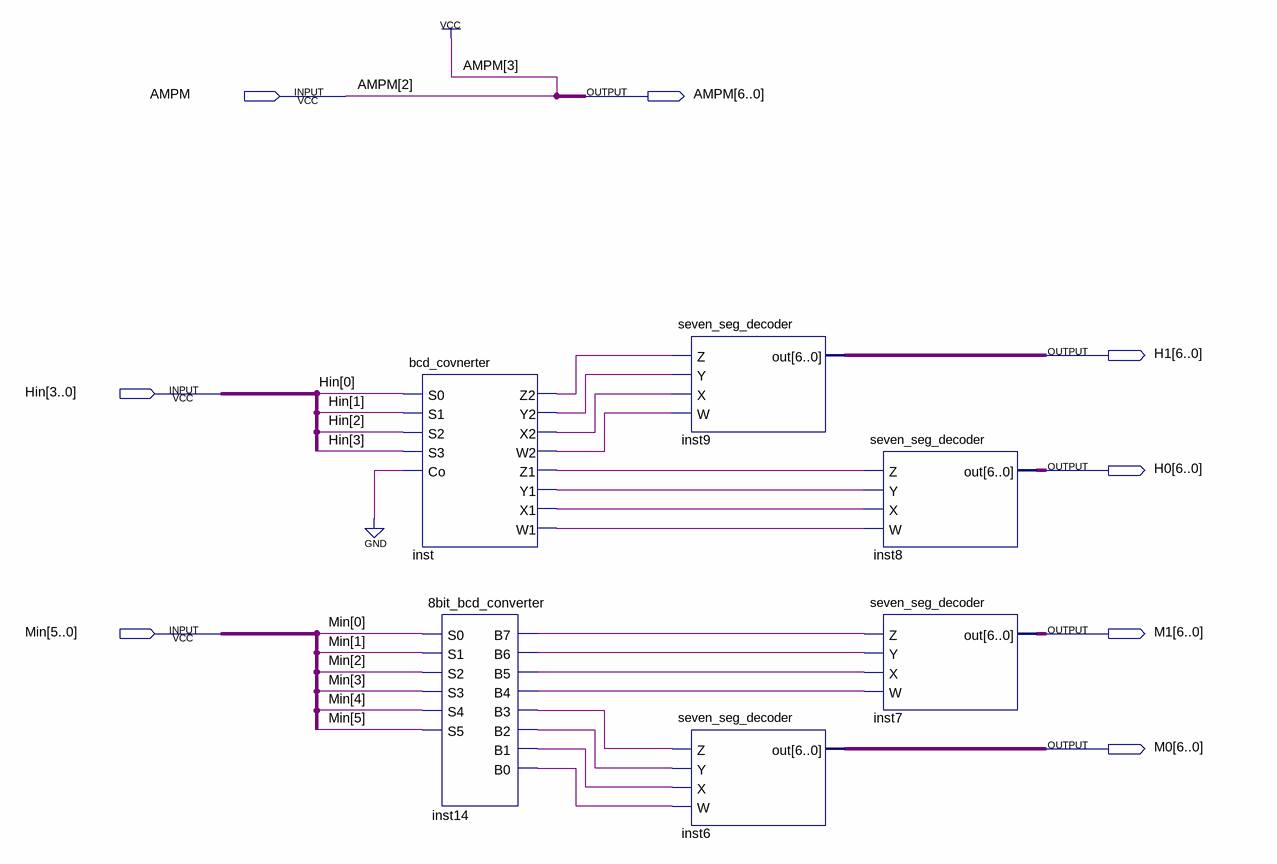
[diagram p0: schematic sheet]
// Quartus schematic timeDecoder.bdf as structural Verilog: 6 symbols, 8 pins
module timeDecoder (
  input  AMPM_1bit,
  input  [3:0] Hin,
  input  [5:0] Min,
  output [6:0] AMPM,
  output [6:0] H1,
  output [6:0] H0,
  output [6:0] M1,
  output [6:0] M0
);

  wire inst14_b0, inst14_b1, inst14_b2, inst14_b3, inst14_b4, inst14_b5, inst14_b6, inst14_b7, inst_w1,
       inst_w2, inst_x1, inst_x2, inst_y1, inst_y2, inst_z1, inst_z2;

  bcd_covnerter inst (
    .S0(Hin[0]), .S1(Hin[1]), .S2(Hin[2]), .S3(Hin[3]), .Co(1'b0), .Z2(inst_z2), .Y2(inst_y2), .X2(inst_x2),
    .W2(inst_w2), .Z1(inst_z1), .Y1(inst_y1), .X1(inst_x1), .W1(inst_w1));
  \8bit_bcd_converter  inst14 (
    .S0(Min[0]), .S1(Min[1]), .S2(Min[2]), .S3(Min[3]), .S4(Min[4]), .S5(Min[5]), .B7(inst14_b7),
    .B6(inst14_b6), .B5(inst14_b5), .B0(inst14_b0), .B4(inst14_b4), .B3(inst14_b3), .B2(inst14_b2),
    .B1(inst14_b1));
  seven_seg_decoder inst9 (.Z(inst_z2), .Y(inst_y2), .X(inst_x2), .W(inst_w2), .out(H1));
  seven_seg_decoder inst6 (.Z(inst14_b3), .Y(inst14_b2), .X(inst14_b1), .W(inst14_b0), .out(M0));
  seven_seg_decoder inst8 (.Z(inst_z1), .Y(inst_y1), .X(inst_x1), .W(inst_w1), .out(H0));
  seven_seg_decoder inst7 (.Z(inst14_b7), .Y(inst14_b6), .X(inst14_b5), .W(inst14_b4), .out(M1));

  assign AMPM[3:2] = {1'b1, AMPM_1bit};
endmodule
